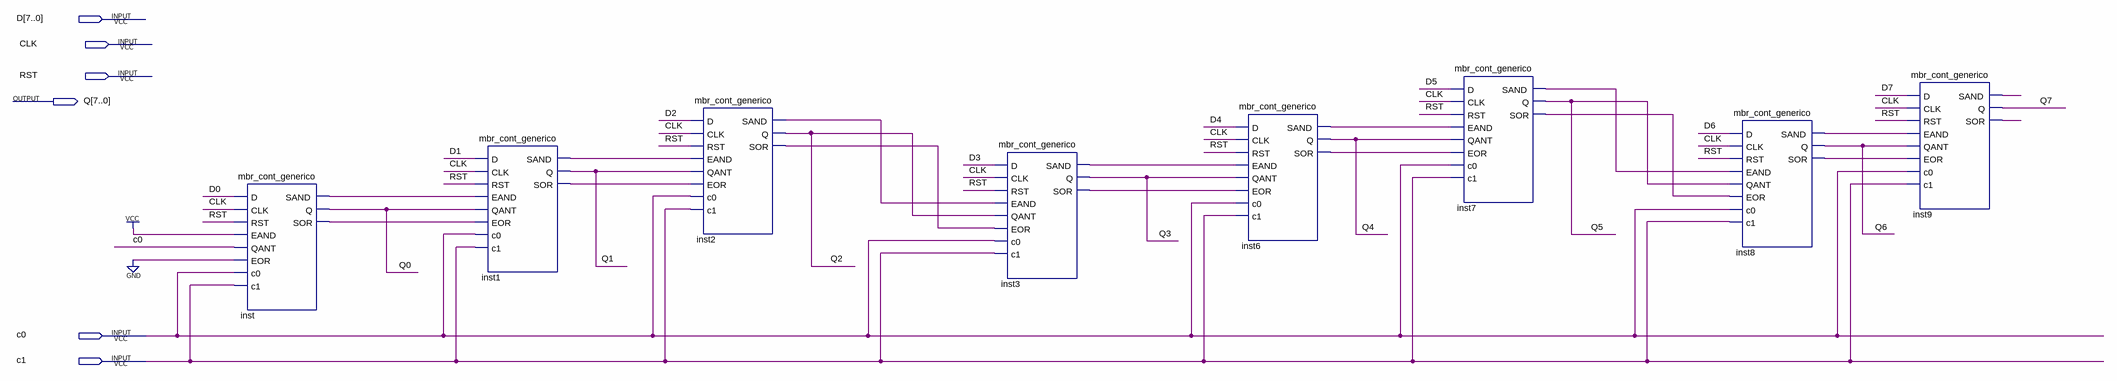
[diagram p0: schematic sheet]
// Quartus schematic mbr_cont_8b.bdf as structural Verilog: 8 symbols, 6 pins
module mbr_cont_8b (
  input  [7:0] D,
  input  CLK,
  input  RST,
  input  c0,
  input  c1,
  output [7:0] Q
);

  wire inst1_sand, inst1_sor, inst2_sand, inst2_sor, inst3_sand, inst3_sor, inst6_sand, inst6_sor,
       inst7_sand, inst7_sor, inst8_sand, inst8_sor, inst9_sand, inst9_sor, inst_sand, inst_sor;

  mbr_cont_generico inst (
    .D(D[0]), .CLK(CLK), .RST(RST), .EAND(1'b1), .QANT(c0), .EOR(1'b0), .c0(c0), .c1(c1), .SAND(inst_sand),
    .Q(Q[0]), .SOR(inst_sor));
  mbr_cont_generico inst1 (
    .D(D[1]), .CLK(CLK), .RST(RST), .EAND(inst_sand), .QANT(Q[0]), .EOR(inst_sor), .c0(c0), .c1(c1),
    .SAND(inst1_sand), .Q(Q[1]), .SOR(inst1_sor));
  mbr_cont_generico inst2 (
    .D(D[2]), .CLK(CLK), .RST(RST), .EAND(inst1_sand), .QANT(Q[1]), .EOR(inst1_sor), .c0(c0), .c1(c1),
    .SAND(inst2_sand), .Q(Q[2]), .SOR(inst2_sor));
  mbr_cont_generico inst3 (
    .D(D[3]), .CLK(CLK), .RST(RST), .EAND(inst2_sand), .QANT(Q[2]), .EOR(inst2_sor), .c0(c0), .c1(c1),
    .SAND(inst3_sand), .Q(Q[3]), .SOR(inst3_sor));
  mbr_cont_generico inst6 (
    .D(D[4]), .CLK(CLK), .RST(RST), .EAND(inst3_sand), .QANT(Q[3]), .EOR(inst3_sor), .c0(c0), .c1(c1),
    .SAND(inst6_sand), .Q(Q[4]), .SOR(inst6_sor));
  mbr_cont_generico inst7 (
    .D(D[5]), .CLK(CLK), .RST(RST), .EAND(inst6_sand), .QANT(Q[4]), .EOR(inst6_sor), .c0(c0), .c1(c1),
    .SAND(inst7_sand), .Q(Q[5]), .SOR(inst7_sor));
  mbr_cont_generico inst8 (
    .D(D[6]), .CLK(CLK), .RST(RST), .EAND(inst7_sand), .QANT(Q[5]), .EOR(inst7_sor), .c0(c0), .c1(c1),
    .SAND(inst8_sand), .Q(Q[6]), .SOR(inst8_sor));
  mbr_cont_generico inst9 (
    .D(D[7]), .CLK(CLK), .RST(RST), .EAND(inst8_sand), .QANT(Q[6]), .EOR(inst8_sor), .c0(c0), .c1(c1),
    .SAND(inst9_sand), .Q(Q[7]), .SOR(inst9_sor));
endmodule
